# Altium schematic sheet Schematic.SchDoc
size 420 x 297 mm; SheetNumber: 1; SheetTotal: 1
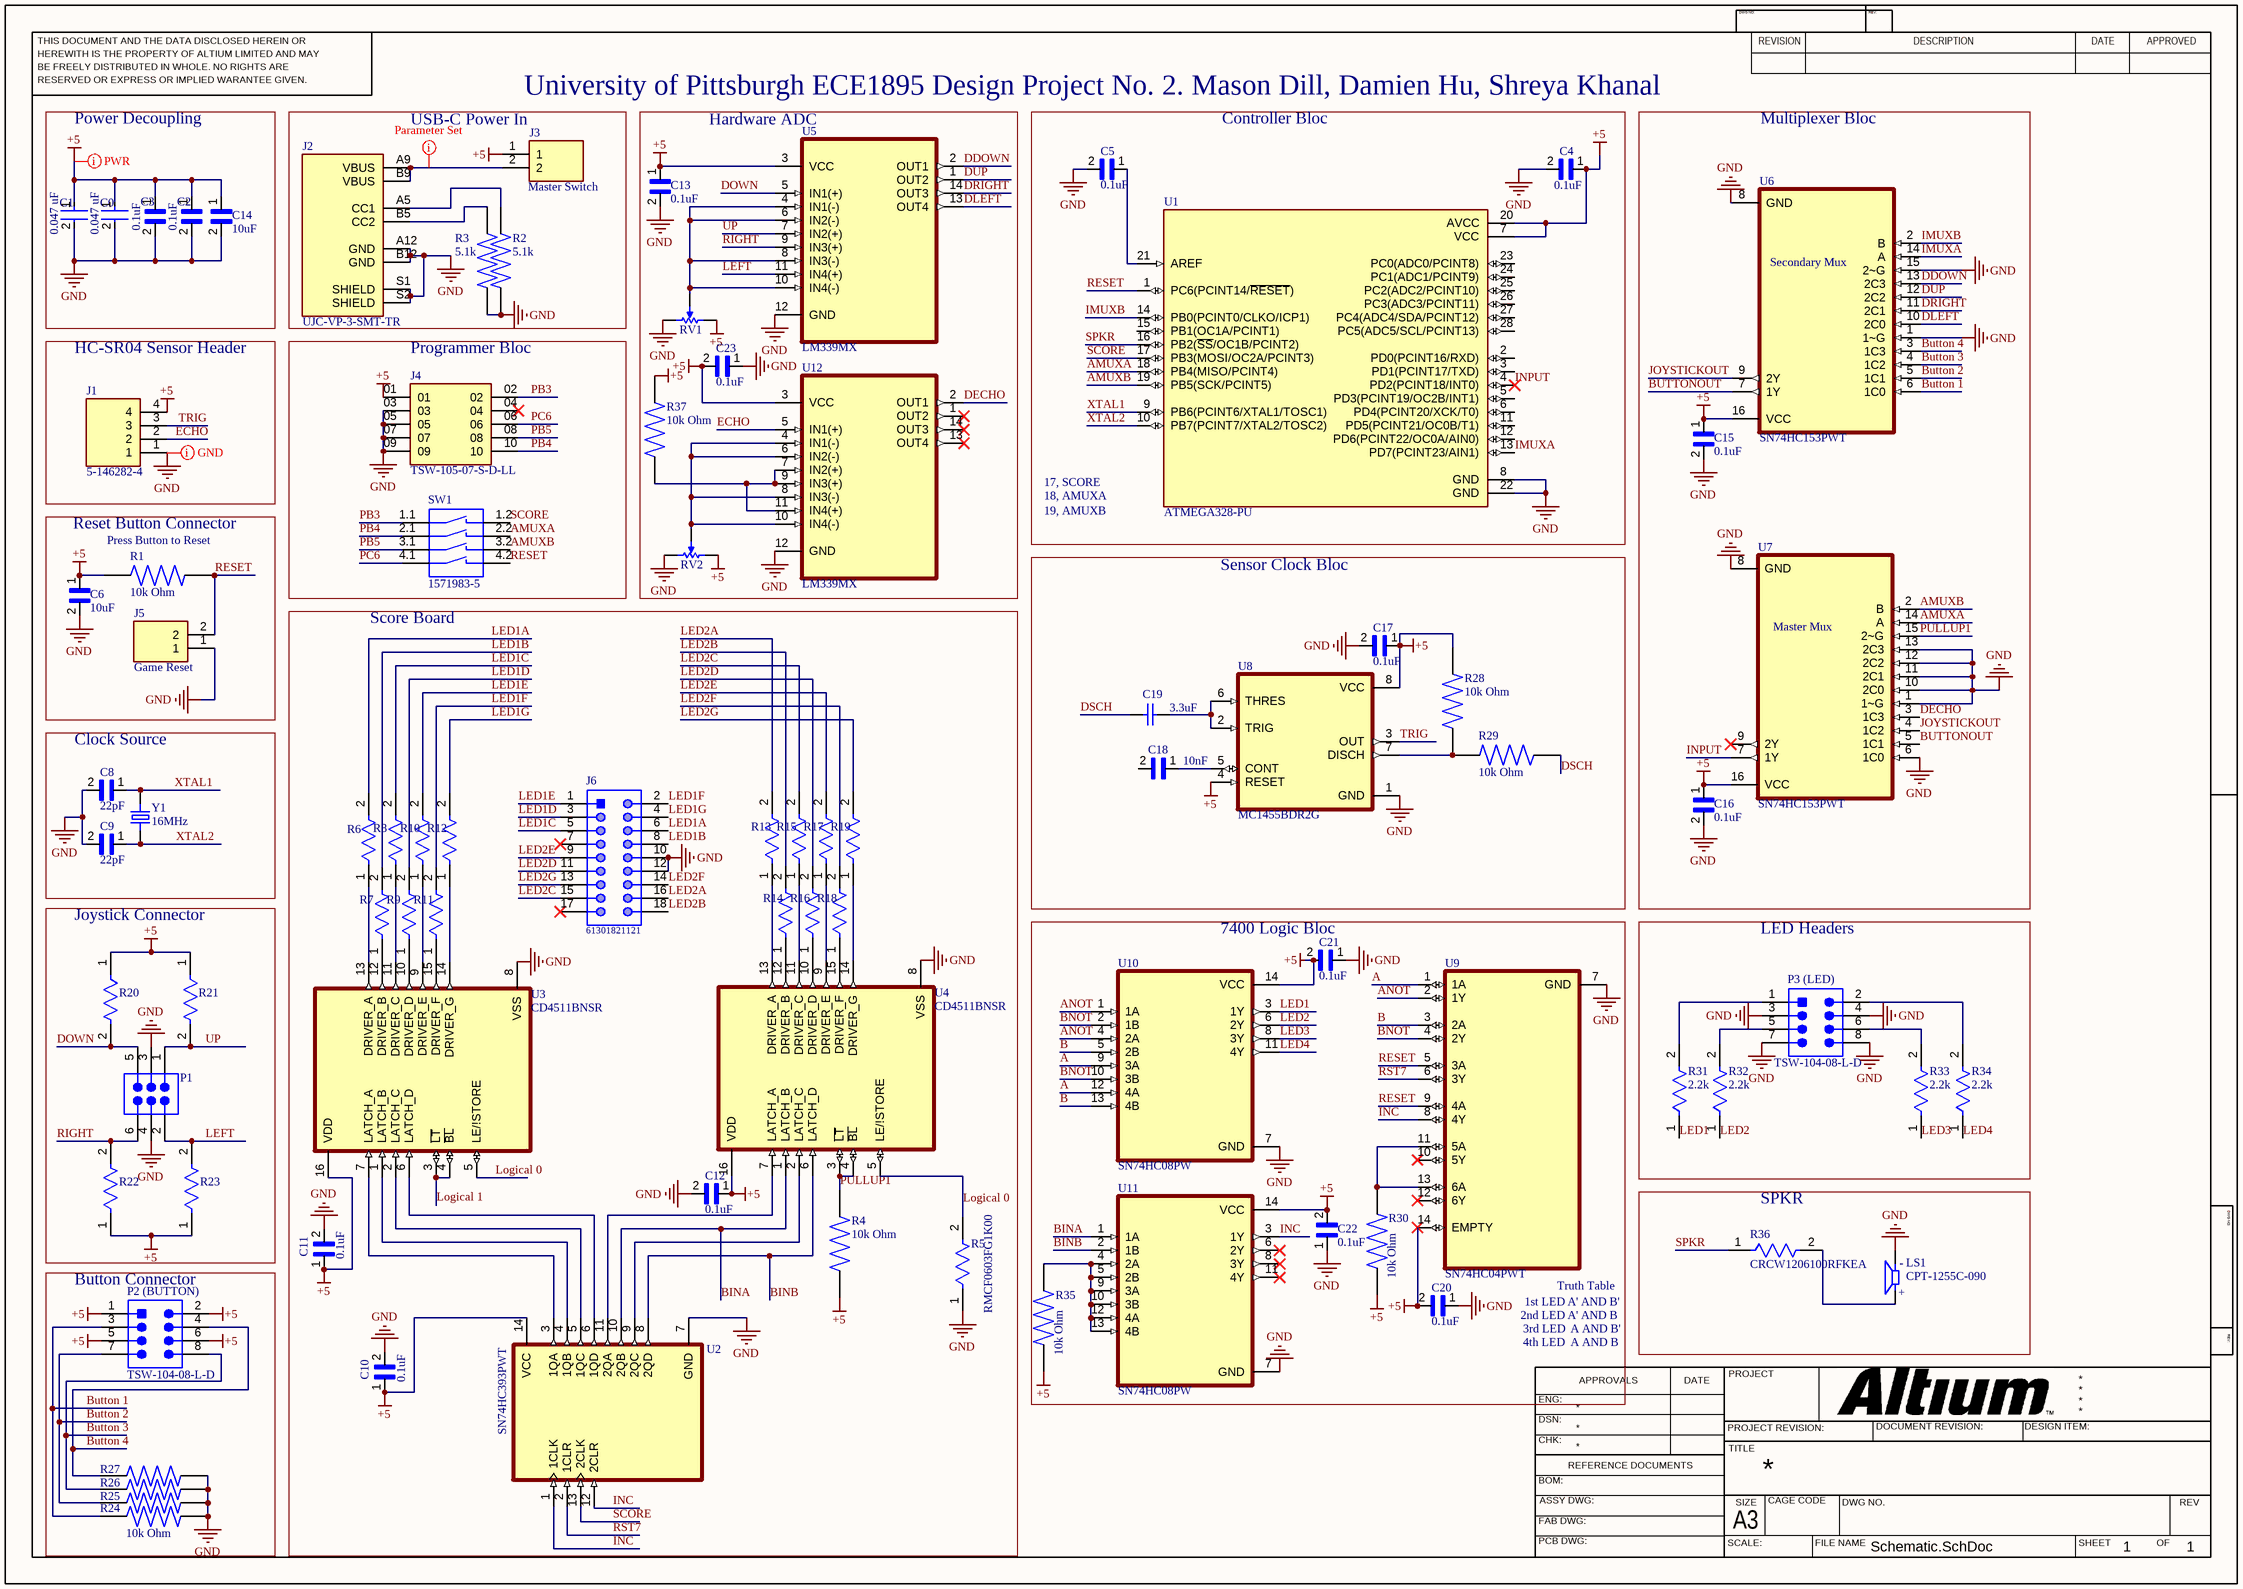
[diagram p0: Schematic.SchDoc]

## Parts
C0  0.047 uF  [FP-C0603C-CF-MFG]
C1  0.047 uF  [FP-C0603C-CF-MFG]
C2  0.1uF  [CAPC1608X90N]
C3  0.1uF  [CAPC1608X90N]
C4  0.1uF  [CAPC1608X90N]
C5  0.1uF  [CAPC1608X90N]
C6  10uF  [CAPC1608X90N]
C8  22pF  [CAPC1608X90N]
C9  22pF  [CAPC1608X90N]
C10  0.1uF  [CAPC1608X90N]
C11  0.1uF  [CAPC1608X90N]
C12  0.1uF  [CAPC1608X90N]
C13  0.1uF  [CAPC1608X90N]
C14  10uF  [CAPC1608X90N]
C15  0.1uF  [CAPC1608X90N]
C16  0.1uF  [CAPC1608X90N]
C17  0.1uF  [CAPC1608X90N]
C18  10nF  [CAPC2012X88N]
C19  3.3uF  [CAPC1608X90X35NL15T15]
C20  0.1uF  [CAPC1608X90N]
C21  0.1uF  [CAPC1608X90N]
C22  0.1uF  [CAPC1608X90N]
C23  0.1uF  [CAPC1608X90N]
J1  5-146282-4  [TE_5-146282-4]
J2  UJC-VP-3-SMT-TR  [CUI_UJC-VP-3-SMT-TR]
J3  Master Switch  [CUI_TB003-500-P02BE]
J4  TSW-105-07-S-D-LL  [SAMTEC_TSW-105-07-S-D-LL]
J5  Game Reset  [CUI_TB003-500-P02BE]
J6  61301821121  [61301821121]
LS1  CPT-1255C-090  [CUI_CPT-1255C-090]
P1  TSW-103-08-G-D  [SMTC-TSW-103-08-X-D]  (value not drawn)
P2_(BUTTON)  TSW-104-08-L-D  [SMTC-TSW-104-08-L-D_V]
P3_(LED)  TSW-104-08-L-D  [SMTC-TSW-104-08-L-D_V]
R1  10k Ohm  [RESC3116X60N]
R2  5.1k  [RESC6332X120N]
R3  5.1k  [RESC6332X120N]
R4  10k Ohm  [RESC3116X60N]
R5  RMCF0603FG1K00  [FP-RMCF0603-IPC_B]
R6  100 Ohm  [FP-CRCW1206-e3-MFG]  (value not drawn)
R7  100 Ohm  [FP-CRCW1206-e3-MFG]  (value not drawn)
R8  100 Ohm  [FP-CRCW1206-e3-MFG]  (value not drawn)
R9  100 Ohm  [FP-CRCW1206-e3-MFG]  (value not drawn)
R10  100 Ohm  [FP-CRCW1206-e3-MFG]  (value not drawn)
R11  100 Ohm  [FP-CRCW1206-e3-MFG]  (value not drawn)
R12  100 Ohm  [FP-CRCW1206-e3-MFG]  (value not drawn)
R13  100 Ohm  [FP-CRCW1206-e3-MFG]  (value not drawn)
R14  100 Ohm  [FP-CRCW1206-e3-MFG]  (value not drawn)
R15  100 Ohm  [FP-CRCW1206-e3-MFG]  (value not drawn)
R16  100 Ohm  [FP-CRCW1206-e3-MFG]  (value not drawn)
R17  100 Ohm  [FP-CRCW1206-e3-MFG]  (value not drawn)
R18  100 Ohm  [FP-CRCW1206-e3-MFG]  (value not drawn)
R19  100 Ohm  [FP-CRCW1206-e3-MFG]  (value not drawn)
R20  CRCW12062K20FKEA  [FP-CRCW1206-e3-IPC_C]  (value not drawn)
R21  CRCW12062K20FKEA  [FP-CRCW1206-e3-IPC_C]  (value not drawn)
R22  CRCW12062K20FKEA  [FP-CRCW1206-e3-IPC_C]  (value not drawn)
R23  CRCW12062K20FKEA  [FP-CRCW1206-e3-IPC_C]  (value not drawn)
R24  10k Ohm  [RESC3116X60N]
R25  10k Ohm  [RESC3116X60N]  (value not drawn)
R26  10k Ohm  [RESC3116X60N]  (value not drawn)
R27  10k Ohm  [RESC3116X60N]  (value not drawn)
R28  10k Ohm  [RESC3116X60N]
R29  10k Ohm  [RESC3116X60N]
R30  10k Ohm  [RESC3116X60N]
R31  2.2k  [FP-CRCW1206-e3-IPC_C]
R32  2.2k  [FP-CRCW1206-e3-IPC_C]
R33  2.2k  [FP-CRCW1206-e3-IPC_C]
R34  2.2k  [FP-CRCW1206-e3-IPC_C]
R35  10k Ohm  [RESC3116X60N]
R36  CRCW1206100RFKEA  [FP-CRCW1206-e3-MFG]
R37  10k Ohm  [RESC3116X60N]
RV1  3290W-1-203  [BOUR-3290W]  (value not drawn)
RV2  3290W-1-203  [BOUR-3290W]  (value not drawn)
SW1  1571983-5  [SW_1571983-5]
U1  ATMEGA328-PU  [DIP787W46P254L3467H508Q28]
U2  SN74HC393PWT  [SOP65P640X120-14N]
U3  CD4511BNSR  [SOP127P780X200-16N]
U4  CD4511BNSR  [SOP127P780X200-16N]
U5  LM339MX  [SOIC127P630X170-14N]
U6  SN74HC153PWT  [SOP65P640X120-16N]
U7  SN74HC153PWT  [SOP65P640X120-16N]
U8  MC1455BDR2G  [SOIC127P599X175-8N]
U9  SN74HC04PWT  [SOP65P640X120-14N]
U10  SN74HC08PW  [SOP65P640X120-14N]
U11  SN74HC08PW  [SOP65P640X120-14N]
U12  LM339MX  [SOIC127P630X170-14N]
Y1  16MHz  [XTAL_ECS-160-20-23A-EN-TR]

## Blocks framed on the sheet
Power Decoupling: C0-C3 C14
USB-C Power In: J2 J3 R2 R3
Hardware ADC: C13 C23 R37 RV1 RV2 U5 U12
Controller Bloc: C4 C5 U1
Multiplexer Bloc: C15 C16 U6 U7
HC-SR04 Sensor Header: J1
Programmer Bloc: J4 SW1
Reset Button Connector: C6 J5 R1
Sensor Clock Bloc: C17-C19 R28 R29 U8
Score Board: C10-C12 J6 R4-R19 U2-U4
Clock Source: C8 C9 Y1
Joystick Connector: P1 R20-R23
7400 Logic Bloc: C20-C22 R30 R35 U9-U11
LED Headers: P3_(LED) R31-R34
SPKR: LS1 R36
Button Connector: P2_(BUTTON) R24-R27

## Nets
+5: C0.1 C1.1 C2.1 C3.1 C4.1 C6.1 C10.1 C11.1 C12.1 C13.1 C14.1 C15.1 C16.1 C17.1 C20.2 C21.2 C22.2 C23.2 J1.4 J3.1 J4.01 P2_(BUTTON).1 P2_(BUTTON).2 P2_(BUTTON).5 P2_(BUTTON).6 R1.1 R4.1 R20.1 R21.1 R22.1 R23.1 R28.2 R30.2 R35.2 R37.2 RV1.1 RV2.1 U1.7(VCC) U1.20(AVCC) U2.14(VCC) U3.16(VDD) U4.16(VDD) U5.3(VCC) U6.16(VCC) U7.16(VCC) U8.4(RESET) U8.8(VCC) U9.14(EMPTY) U10.14(VCC) U11.14(VCC) U12.3(VCC)
GND: C0.2 C1.2 C2.2 C3.2 C4.2 C5.2 C6.2 C8.2 C9.2 C10.2 C11.2 C12.2 C13.2 C14.2 C15.2 C16.2 C17.2 C20.1 C21.1 C22.1 C23.1 J1.1 J2.A12(GND) J2.B12(GND) J2.S1(SHIELD) J2.S2(SHIELD) J4.03 J4.05 J4.07 J4.09 J5.1 J6.10 J6.12 LS1.N P1.3 P1.4 P3_(LED).3 P3_(LED).4 P3_(LED).7 P3_(LED).8 R2.1 R3.1 R5.1 R24.1 R25.1 R26.1 R27.1 RV1.3 RV2.3 U1.8(GND) U1.22(GND) U2.7(GND) U3.8(VSS) U4.8(VSS) U5.12(GND) U6.1(1~G) U6.8(GND) U6.15(2~G) U7.1(1~G) U7.6(1C0) U7.8(GND) U7.10(2C0) U7.11(2C1) U7.12(2C2) U7.13(2C3) U8.1(GND) U9.7(GND) U10.7(GND) U11.7(GND) U12.12(GND)
A: U9.1(1A) U10.9(3A) U10.12(4A)
AMUXA: SW1.2.2 U1.18(PB4(MISO/PCINT4)) U7.14(A)
AMUXB: SW1.3.2 U1.19(PB5(SCK/PCINT5)) U7.2(B)
ANOT: U9.2(1Y) U10.1(1A) U10.4(2A)
B: U9.3(2A) U10.5(2B) U10.13(4B)
BINA: U2.10(2QB) U4.1(LATCH_B) U11.1(1A)
BINB: U2.8(2QD) U4.6(LATCH_D) U11.2(1B)
BNOT: U9.4(2Y) U10.2(1B) U10.10(3B)
Button 1: P2_(BUTTON).3 R24.2 U6.6(1C0)
Button 2: P2_(BUTTON).7 R25.2 U6.5(1C1)
Button 3: P2_(BUTTON).8 R26.2 U6.4(1C2)
Button 4: P2_(BUTTON).4 R27.2 U6.3(1C3)
BUTTONOUT: U6.7(1Y) U7.5(1C1)
DDOWN: U5.2(OUT1) U6.13(2C3)
DECHO: U7.3(1C3) U12.2(OUT1)
DLEFT: U5.13(OUT4) U6.10(2C0)
DOWN: P1.5 R20.2 U5.5(IN1(+))
DRIGHT: U5.14(OUT3) U6.11(2C1)
DSCH: C19.1 R29.2
DUP: U5.1(OUT2) U6.12(2C2)
ECHO: J1.2 U12.5(IN1(+))
IMUXA: U1.13(PD7(PCINT23/AIN1)) U6.14(A)
IMUXB: U1.14(PB0(PCINT0/CLKO/ICP1)) U6.2(B)
INC: U2.1(1CLK) U2.12(2CLR) U9.8(4Y) U11.3(1Y)
INPUT: U1.4(PD2(PCINT18/INT0)) U7.7(1Y)
JOYSTICKOUT: U6.9(2Y) U7.4(1C2)
LED1: R31.1 U10.3(1Y)
LED1A: J6.6 R6.2
LED1B: J6.8 R7.2
LED1C: J6.5 R8.2
LED1D: J6.3 R9.2
LED1E: J6.1 R10.2
LED1F: J6.2 R11.2
LED1G: J6.4 R12.2
LED2: R32.1 U10.6(2Y)
LED2A: J6.16 R13.2
LED2B: J6.18 R14.2
LED2C: J6.15 R15.2
LED2D: J6.11 R16.2
LED2E: J6.9 R17.2
LED2F: J6.14 R18.2
LED2G: J6.13 R19.2
LED3: R33.1 U10.8(3Y)
LED4: R34.1 U10.11(4Y)
LEFT: P1.2 R23.2 U5.11(IN4(+))
Logical 0: R5.2 U3.5(LE/!STORE) U4.5(LE/!STORE)
Logical 1: U3.3(~{LT}) U3.4(~{BL})
PB3: J4.02 SW1.1.1
PB4: J4.10 SW1.2.1
PB5: J4.08 SW1.3.1
PC6: J4.06 SW1.4.1
PULLUP1: R4.2 U4.3(~{LT}) U4.4(~{BL}) U7.15(2~G)
RESET: J5.2 R1.2 SW1.4.2 U1.1(PC6(PCINT14/~{RESET})) U9.5(3A) U9.9(4A)
RIGHT: P1.6 R22.2 U5.9(IN3(+))
RST7: U2.2(1CLR) U9.6(3Y)
SCORE: SW1.1.2 U1.17(PB3(MOSI/OC2A/PCINT3)) U2.13(2CLK)
SPKR: R36.1 U1.16(PB2(~{SS}/OC1B/PCINT2))
TRIG: J1.3 U8.3(OUT)
UP: P1.1 R21.2 U5.7(IN2(+))
XTAL1: C8.1 U1.9(PB6(PCINT6/XTAL1/TOSC1)) Y1.2(OUT/IN)
XTAL2: C9.1 U1.10(PB7(PCINT7/XTAL2/TOSC2)) Y1.1(IN/OUT)
NetC5_1: C5.1 U1.21(AREF)
NetC18_1: C18.1 U8.5(CONT)
NetC19_2: C19.2 U8.2(TRIG) U8.6(THRES)
NetJ2_A5: J2.A5(CC1) R2.2
NetJ2_A9: J2.A9(VBUS) J2.B9(VBUS) J3.2
NetJ2_B5: J2.B5(CC2) R3.2
NetLS1_P: LS1.P R36.2
NetP3_(LED)_1: P3_(LED).1 R31.2
NetP3_(LED)_2: P3_(LED).2 R34.2
NetP3_(LED)_5: P3_(LED).5 R32.2
NetP3_(LED)_6: P3_(LED).6 R33.2
NetR6_1: R6.1 U3.13(DRIVER_A)
NetR7_1: R7.1 U3.12(DRIVER_B)
NetR8_1: R8.1 U3.11(DRIVER_C)
NetR9_1: R9.1 U3.10(DRIVER_D)
NetR10_1: R10.1 U3.9(DRIVER_E)
NetR11_1: R11.1 U3.15(DRIVER_F)
NetR12_1: R12.1 U3.14(DRIVER_G)
NetR13_1: R13.1 U4.13(DRIVER_A)
NetR14_1: R14.1 U4.12(DRIVER_B)
NetR15_1: R15.1 U4.11(DRIVER_C)
NetR16_1: R16.1 U4.10(DRIVER_D)
NetR17_1: R17.1 U4.9(DRIVER_E)
NetR18_1: R18.1 U4.15(DRIVER_F)
NetR19_1: R19.1 U4.14(DRIVER_G)
NetR28_1: R28.1 R29.1 U8.7(DISCH)
NetR30_1: R30.1 U9.11(5A) U9.13(6A)
NetR35_1: R35.1 U11.4(2A) U11.5(2B) U11.9(3A) U11.10(3B) U11.12(4A) U11.13(4B)
NetR37_1: R37.1 U12.7(IN2(+)) U12.9(IN3(+)) U12.11(IN4(+))
NetRV1_2: RV1.2 U5.4(IN1(-)) U5.6(IN2(-)) U5.8(IN3(-)) U5.10(IN4(-))
NetRV2_2: RV2.2 U12.4(IN1(-)) U12.6(IN2(-)) U12.8(IN3(-)) U12.10(IN4(-))
NetU2_3: U2.3(1QA) U3.7(LATCH_A)
NetU2_4: U2.4(1QB) U3.1(LATCH_B)
NetU2_5: U2.5(1QC) U3.2(LATCH_C)
NetU2_6: U2.6(1QD) U3.6(LATCH_D)
NetU2_9: U2.9(2QC) U4.2(LATCH_C)
NetU2_11: U2.11(2QA) U4.7(LATCH_A)

Not connected (* = marked no-connect by the designer): C18 2; J4 04*; J6 7* 17*; U1 2(PD0(PCINT16/RXD)) 3(PD1(PCINT17/TXD)) 5(PD3(PCINT19/OC2B/INT1)) 6(PD4(PCINT20/XCK/T0)) 11(PD5(PCINT21/OC0B/T1)) 12(PD6(PCINT22/OC0A/AIN0)) 15(PB1(OC1A/PCINT1)) 23(PC0(ADC0/PCINT8)) 24(PC1(ADC1/PCINT9)) 25(PC2(ADC2/PCINT10)) 26(PC3(ADC3/PCINT11)) 27(PC4(ADC4/SDA/PCINT12)) 28(PC5(ADC5/SCL/PCINT13)); U7 9(2Y)*; U9 10(5Y)* 12(6Y)*; U11 6(2Y)* 8(3Y)* 11(4Y)*; U12 1(OUT2)* 13(OUT4)* 14(OUT3)*

## Layout directives
rule Width Constraint [Pref Width = 20mil    Min Width = 10mil    Max Width = 20mil]: +5, GND
rule Width Constraint [Pref Width = 20mil    Min Width = 20mil    Max Width = 20mil]: NetJ2_A9

## Notes on the sheet
- University of Pittsburgh ECE1895 Design Project No. 2. Mason Dill, Damien Hu, Shreya Khanal
- (near U6) Secondary Mux
- 18, AMUXA
- 19, AMUXB
- 17, SCORE
- (near R1) Press Button to Reset
- (near U7) Master Mux
- 2nd LED
- 3rd LED
- 1st LED
- (near U9) Truth Table
- A' AND B'
- A' AND B
- A AND B'
- 4th LED
- A AND B
- THIS DOCUMENT AND THE DATA DISCLOSED HEREIN OR
- HEREWITH IS THE PROPERTY OF ALTIUM LIMITED AND MAY
- DWG NO:
- REVISION
- REV:
- DESCRIPTION
- DATE
- APPROVED
- BE FREELY DISTRIBUTED IN WHOLE. NO RIGHTS ARE
- RESERVED OR EXPRESS OR IMPLIED WARANTEE GIVEN.
- ENG:
- APPROVALS
- PROJECT
- DSN:
- CHK:
- REFERENCE DOCUMENTS
- PROJECT REVISION:
- TITLE
- DOCUMENT REVISION:
- DESIGN ITEM:
- BOM:
- FAB DWG:
- PCB DWG:
- ASSY DWG:
- SCALE:
- A3
- SIZE
- CAGE CODE
- FILE NAME
- DWG NO.
- SHEET
- OF
- REV
- (in symbol CPT-1255C-090) -; +

## Library data of the parts
C0 C1 = CMP-1035-02515-3: CAP CER 0.047UF 100V 5% X7R 0603; Manufacturer: KEMET; Manufacturer Part Number: C0603C473J1RACTU; Tolerance: 0.05; Value: 47,000 pF; Material: Ceramic; Temperature Coefficient: 30ppm/°C; Automotive Grade: Grade 1; Octopart: https://octopart.com/c0603c473j1ractu-kemet-17301356; Temperature Range Low: -55°C; Temperature Characteristic: X7R; Lead Free: Yes; ComponentLink2Description: Datasheet; Digikey Description: CAP CER 0.047UF 100V 5% X7R 0603; Device Class L2: Capacitors; Temperature Range High: +125°C; Device Class L1: Passive Components; Device Class L3: Ceramic Capacitors; Category: Cap; Package: C0603C-CF; Height: 0.87mm; Temperature: -55°C to +125°C; Voltage Rating: 100 V; Capacitance: 47,000 pF; RoHS: TRUE; Mouser Description: Multilayer Ceramic Capacitors MLCC - SMD/SMT 100volts 47000pF X7R 5%; Automotive: Yes; ComponentLink2URL: https://api.kemet.com/component-edge/download/datasheet/C0603C100J5GACAUTO.pdf
C2-C5 C10-C13 C15-C17 C20-C23 = EMK107B7104KAHT: 0.1ÂµF Â±10% 16V Ceramic Capacitor X7R 0603 _1608 Metric_; MF: Taiyo Yuden; SnapEDA_Link: https://www.snapeda.com/parts/EMK107B7104KAHT/Taiyo%20Yuden/view-part/588112/?ref=snap; Value: *; Digi-Key_Part_Number: 587-6004-1-ND; Digi-Key_Purchase_URL: https://www.digikey.in/product-detail/en/taiyo-yuden/EMK107B7104KAHT/587-6004-1-ND/8040667?utm_source=snapeda&utm_medium=aggregator&utm_campaign=symbol; MP: EMK107B7104KAHT; Package: 1608 Taiyo Yuden
C6 C14 = C1608JB1A106K080AC: 10 ÂµF Â±10% 10V Ceramic Capacitor JB 0603 (1608 Metric); MF: TDK; Value: *; SnapEDA_Link: https://www.snapeda.com/parts/C1608JB1A106K080AC/TDK/view-part/?ref=snap; MP: C1608JB1A106K080AC; Package: 1608 TDK; Check_prices: https://www.snapeda.com/parts/C1608JB1A106K080AC/TDK/view-part/?ref=eda; Digi-Key_Part_Number: 445-11201-2-ND; Purchase-URL: https://pricing.snapeda.com/search/part/C1608JB1A106K080AC/?ref=eda
C8 C9 = C0603C220J3GACAUTO: 22pF Â±5% 25V Ceramic Capacitor C0G, NP0 0603 _1608 Metric_; MF: KEMET; Package: 0603 KEMET; Digi-Key_Purchase_URL: https://www.digikey.com/product-detail/en/kemet/C0603C220J3GACAUTO/399-6864-1-ND/3314377?utm_source=snapeda&utm_medium=aggregator&utm_campaign=symbol; Value: *; MP: C0603C220J3GACAUTO; SnapEDA_Link: https://www.snapeda.com/parts/C0603C220J3GACAUTO/KEMET/view-part/1772422/?ref=snap; Digi-Key_Part_Number: 399-6864-1-ND
C18 = C0805C103K1RECAUTO: Package: None; Price: None; Value: *; MP: C0805C103K1RECAUTO; Availability: Unavailable
C19 = CMP-1035-02770-2: Part Number: C0603C335M9PACTU; Manufacturer: Kemet
J1 = 5-146282-4: Connector Header Through Hole 4 position 0.100 (2.54mm); MF: TE Connectivity; Value: *; SnapEDA_Link: https://www.snapeda.com/parts/5-146282-4/TE%20Connectivity%20AMP%20Connectors/view-part/2410903/?ref=snap; EU_RoHS_Compliance: Compliant; Mouser-Purchase-URL: https://snapeda.com/shop?store=Mouser&id=2410903; Availability: Unavailable; Price: None; Package: None; DigiKey-Purchase-URL: https://snapeda.com/shop?store=DigiKey&id=2410903; MP: 5-146282-4
J2 = UJC-VP-3-SMT-TR: USB Receptacle; MF: {'manufacturer': u'CUI'}; Value: *; Price: None; MP: UJC-VP-3-SMT-TR; Availability: Unavailable; Package: None
J3 J5 = TB003-500-P02BE: 2~24 Poles, Screw Type, Horizontal, 5.0 Pitch, 26~14 _AWG_, Terminal Block Connector; MF: CUI Devices; MP: TB003-500-P02BE; Availability: Unavailable; Package: None; SnapEDA_Link: https://www.snapeda.com/parts/TB003-500-P02BE/CUI%20Devices/view-part/3590637/?ref=snap; Price: None; Value: *
J6 = CMP-1502-01101-1: THT Vertical Pin Header WR-PHD, Pitch 2.54 mm, Dual Row, 18 pins; Manufacturer: Wurth Elektronik; Withstanding Voltage: 500VAC; Pin Number: 18; Pitch: 2.54mm; Rated Current: 3A; Contact Resistance: 20mOhm; Gender: Male; Working Voltage: 250VAC; Publisher: WurthElektronik; Packaging: Bag; Row Number: Dual; Datasheet URL: https://katalog.we-online.de/em/datasheet/6130xx21121.pdf; Mounting Technology: THT; Orientation: Vertical; Part Number: 61301821121; Package Reference: 61301821121; Manufacturer URL: http://www.we-online.de; Operating Temperature: -40to105degC
LS1 = CPT-1255C-090: 12 mm, 20 Vp-p, 80 dB, Through Hole, Piezo Audio Transducer Buzzer; MF: CUI Devices; SnapEDA_Link: https://www.snapeda.com/parts/CPT-1255C-090/CUI%20Devices/view-part/2202985/?ref=snap; MP: CPT-1255C-090; Availability: Unavailable; Price: None; Value: *
P1 = CMP-1024-00338-1: 0.025" SQ Post Header, Through-hole, Vertical, -55 to 125 degC, 2.54 mm Pitch, 6-Pin, Male, RoHS; Manufacturer: Samtec; Pitch: 2.54 mm; ComponentLink1URL: http://www.samtec.com; ComponentLink2URL: http://www.samtec.com/documents/webfiles/pdf/TSW_TH.PDF; Temperature Range: -55 to 125 degC; RoHS: True; ComponentLink2Description: Datasheet; PackageReference: TSW-103-08-X-D; ComponentLink3Description: Package Specification; PackageDescription: .025[0.64] SQ. Post Terminal Strip Assembly; DatasheetVersion: F-214; Mounting Technology: Through-hole; ComponentLink1Description: Manufacturer URL; Orientation: Vertical; PartNumber: TSW-103-08-G-D; PackageVersion: DM, 8/1988; ComponentLink3URL: http://www.samtec.com/documents/webfiles/cpdf/TSW-XXX-XX-XXX-X-XX-XXX-MKT.pdf
P2_(BUTTON) P3_(LED) = CMP-1681-00006-4: Male Header, Pitch 2.54 mm, 2 x 4 Position, Height 8.38 mm, Tail Length 5.08 mm, -55 to 125 degC, RoHS, Bulk; Manufacturer: Samtec; Voltage Rating: 550 V; Current Rating: 7.6 A; Rows: 2; ComponentLink2URL: https://datasheet.ciiva.com/25616/0900766b81154476-25616879.pdf; Package Quantity: 1; PackageDescription: Male Header, Pitch 2.54 mm, 2 x 4 Position, Height 8.38 mm, Tail Length 5.08 mm; ComponentLink1Description: Manufacturer URL; Lead Pitch: 0.1 inch; REACH SVHC: No SVHC; Mounting Technology: Through Hole; PackageReference: TSW-104-08-L-D; Contact Plating: Gold; DatasheetVersion: 04/2012; Colour: Black; Contact Finish: Gold; ComponentLink3URL: http://suddendocs.samtec.com/prints/tsw-xxx-xx-x-x-xx-xxx-footprint.pdf; ComponentLink3Description: Package Specification; Mount: Through Hole; RoHSCompliant: true; Packaging: Bulk; ComponentLink2Description: Datasheet; Contact Material: Bronze; Pins: 8; ComponentLink1URL: http://www.samtec.com/
R1 R4 R24-R30 R35 R37 = CRCW120610K0DHEAP: Package: None; Price: None; Value: *; MP: CRCW120610K0DHEAP; Availability: Unavailable
R2 R3 = 35225K1FT: Res Thick Film 2512 5.1K Ohm 1% 3W SMD T/R; Package: None; Price: None; Value: *; MP: 35225K1FT; Availability: Unavailable
R5 = CMP-26527-003160-1: 1kΩ ±1% 0.1W 0603 Thick Film Chip Resistor AEC-Q200 compliant; Max Power Dissipation: 100mW; Temperature Coefficient: 100ppm/°C; Resistance: 1kR; Radiation Hardening: No; Case Code (Metric): 1608; Length: 0.061inch; Series: RMCF; Resistor Type: Thick Film; Tolerance: 1%; Height: 0.022inch; Mount: Surface Mount; Number of Terminations: 2; Max Operating Temperature: 155°C; Min Operating Temperature: -55°C; Lead Free: Lead Free; Case/Package: 0603; Contact Plating: Tin; Packaging: Tape and Reel; RoHS Compliant: Yes; Width: 0.031inch; Case Code (Imperial): 0603; Features: Automotive AEC-Q200
R6-R19 R36 = CMP-2003-04801-2: RES Thick Film, 100Ω, 1%, 0.25W, 100ppm/°C, 1206; Voltage Rating (DC): 200V; Resistance: 100R; Power Rating: 250mW; Case Code (Metric): 3216; Radiation Hardening: No; Height: 0.55mm; Packaging: Tape and Reel; Depth: 1.6mm; Weight: 0.000353oz; Termination: SMD/SMT; Lead Free: Lead Free; Min Operating Temperature: -55°C; Contact Plating: Tin; Max Operating Temperature: 155°C; Case Code (Imperial): 1206; Military Standard: Not; Width: 1.6mm; Number of Pins: 2; Voltage Rating: 200V; Composition: Thick Film; Package Quantity: 5000; Tolerance: 1%; Case/Package: 1206; Mount: Surface Mount; Length: 3.2mm; Temperature Coefficient: 100ppm/°C
R20-R23 R31-R34 = CMP-2003-02034-2: RES Thick Film, 2.2kΩ, 1%, 0.25W, 100ppm/°C, 1206; Voltage Rating: 200V; Max Power Dissipation: 250mW; Resistance: 2.2kR; Voltage Rating (DC): 200V; Depth: 1.6mm; Max Operating Temperature: 155°C; Width: 1.6mm; Packaging: Tape and Reel; Min Operating Temperature: -55°C; Military Standard: Not; Weight: 0.000353oz; Package Quantity: 10; Case Code (Metric): 3216; Length: 3.2mm; Lead Free: Lead Free; Case/Package: 1206; Number of Terminations: 2; Temperature Coefficient: 100ppm/°C; Case Code (Imperial): 1206; Power Rating: 250mW; Contact Plating: Tin; Composition: Thick Film; Features: Automotive AEC-Q200; Termination: SMD/SMT; Height: 0.55mm; Tolerance: 1%; Radiation Hardening: No
RV1 RV2 = CMP-2000-05581-1: Trimming Potentiometer, 20 KOhm, 1 W, -65 to 150 degC, 3-Pin THD, RoHS, Tube; Manufacturer: Bourns; No. of Turns: 25; Potentiometer Mounting: ThroughHole; Temperature Coefficient: ±50ppm/°C; Power Rating: 1W; SVHC: NoSVHC(15-Jun-2015); Resistance Tolerance: ±5%; Product Range: AEC-Q2003290WSeries; Track Resistance: 20kohm; Datasheet URL: http://www.bourns.com/docs/Product-Datasheets/3290.pdf; Datasheet Version: 04/2014; Mounting Technology: ThroughHole; Package Description: 3-Pin Through Hole Device, Body 9.53 x 3.81 mm, Pitch 2.54 mm; Manufacturer URL: http://www.bourns.com/; Package Reference: 3290W
SW1 = 1571983-5: GDH04STR04=DIP SWITCH; Configuration_Pole-Throw: Single Pole - Single Throw; Switch_Type: DIP; Voltage_Rating: 50 VDC; Contact_Current_Rating: .1 A; MF: TE Connectivity; Digi-Key_Part_Number: 450-1762-1-ND; SnapEDA_Link: https://www.snapeda.com/parts/1571983-5/TE%20Connectivity%20ALCOSWITCH%20Switches/view-part/238185/?ref=snap; MP: 1571983-5; Value: *; TE_purchase_URL: https://www.te.com/usa-en/product-1571983-5.html?te_bu=Cor&te_type=disp&te_campaign=seda_glo_cor-seda-global-disp-prtnr-fy19-seda-model-bom-cta_sma-317_1&elqCampaignId=32493; Package: DIP-4 TE Connectivity; Digi-Key_Purchase_URL: https://www.digikey.com/product-detail/en/te-connectivity-alcoswitch-switches/1571983-5/450-1762-1-ND/1207171?utm_source=snapeda&utm_medium=aggregator&utm_campaign=symbol
U1 = ATMEGA328-PU: AVR AVRÂ® ATmega Microcontroller IC 8-Bit 20MHz 32KB (16K x 16) FLASH 28-PDIP; MF: Microchip Technology; Value: *; Package: DIP-28 Microchip Technology; Availability: In Stock; Check_prices: https://www.snapeda.com/parts/ATMEGA328-PU/Microchip/view-part/?ref=eda; SnapEDA_Link: https://www.snapeda.com/parts/ATMEGA328-PU/Microchip/view-part/?ref=snap; Purchase-URL: https://pricing.snapeda.com/search/part/ATMEGA328-PU/?ref=eda; MP: ATMEGA328-PU; Price: None
U5 U12 = LM339MX: Quad Comparator; Package: None; Price: None; Value: *; MP: LM339MX; Availability: Unavailable
U6 U7 = SN74HC153N: IC MULTIPLEXER 2 X 4:1 16TSSOP; MF: Texas Instruments; SnapEDA_Link: https://www.snapeda.com/parts/SN74HC153N/Texas%20Instruments/view-part/494582/?ref=snap; Price: None; Check_prices: https://www.snapeda.com/parts/SN74HC153N/Texas%20Instruments/view-part/494582/?ref=eda; MP: SN74HC153N; Value: *; Purchase-URL: https://pricing.snapeda.com/search/part/SN74HC153N/?ref=eda; Availability: Good; Package: PDIP-16 Texas Instruments
U8 = NE555DR: Single Precision Timer; MF: Texas Instruments; Mouser-Purchase-URL: https://snapeda.com/shop?store=Mouser&id=44432; DigiKey-Purchase-URL: https://snapeda.com/shop?store=DigiKey&id=44432; SnapEDA_Link: https://www.snapeda.com/parts/NE555DR/Texas%20Instruments/view-part/44432/?ref=snap; MP: NE555DR; Texas_Instruments-Purchase-URL: https://snapeda.com/shop?store=Texas+Instruments&id=44432; Availability: Unavailable; Price: None; Value: *; Package: SOIC-8 Texas Instruments
U9 = SN74HC04PWT: Hex Inverters 14-TSSOP -40 to 85; MF: Texas Instruments; Value: *; Check_prices: https://www.snapeda.com/parts/SN74HC04PWT/Texas+Instruments/view-part/?ref=eda; Digi-Key_Part_Number: 296-SN74HC04PWTTR-ND; Package: TSSOP-14 Texas Instruments; Purchase-URL: https://pricing.snapeda.com/search/part/SN74HC04PWT/?ref=eda; SnapEDA_Link: https://www.snapeda.com/parts/SN74HC04PWT/Texas+Instruments/view-part/?ref=snap; MP: SN74HC04PWT
Y1 = ECS-160-20-23A-EN-TR: 16MHz Â±30ppm Crystal 20pF 60 Ohms 2-SMD, No Lead; MF: ECS Inc.; Digi-Key_Purchase_URL: https://www.digikey.com/product-detail/en/ecs-inc/ECS-160-20-23A-EN-TR/XC982CT-ND/465170?utm_source=snapeda&utm_medium=aggregator&utm_campaign=symbol; MP: ECS-160-20-23A-EN-TR; Package: SMD-2 ECS International; Digi-Key_Part_Number: XC982CT-ND; SnapEDA_Link: https://www.snapeda.com/parts/ECS-160-20-23A-EN-TR/ECS%20Inc./view-part/2122002/?ref=snap; Value: *
J4 = TSW-105-07-S-D-LL: Package: None; Price: None; Value: *; MP: TSW-105-07-S-D-LL; Availability: Unavailable
U2 = SN74HC393PWT: Package: None; Price: None; Value: *; MP: SN74HC393PWT; Availability: Unavailable
U3 U4 = CD4511BNSR: Price: None; MP: CD4511BNSR; Availability: Unavailable; Package: None; Value: *
U10 U11 = SN74HC08PW: Package: None; Price: None; Value: *; MP: SN74HC08PW; Availability: Unavailable